# EAGLE schematic LDR2 (EAGLE 8.2.2)
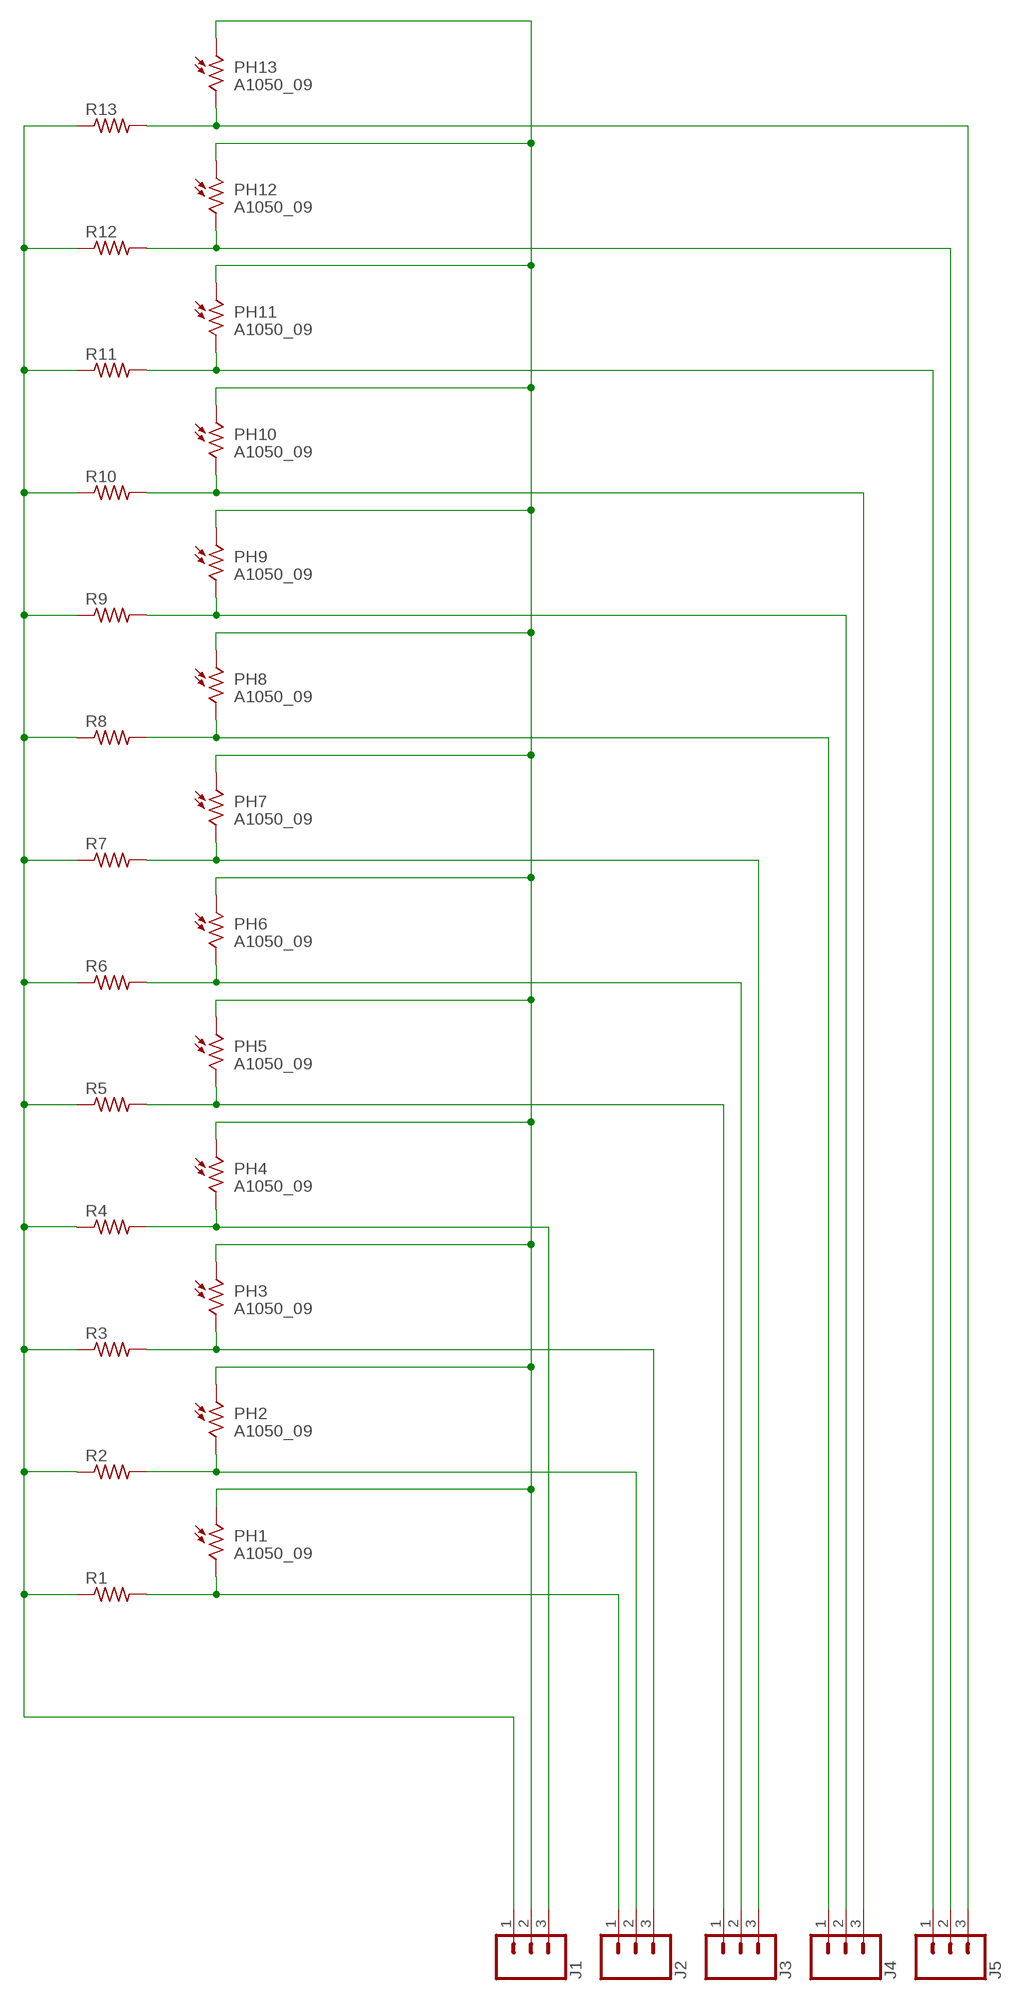
[diagram p0: schematic, sheet 1]

## Parts
J1  CONN_03LONGPADS  [1X03_LONGPADS]
J2  CONN_03LONGPADS  [1X03_LONGPADS]
J3  CONN_03LONGPADS  [1X03_LONGPADS]
J4  CONN_03LONGPADS  [1X03_LONGPADS]
J5  CONN_03LONGPADS  [1X03_LONGPADS]
PH1  A1050_09  [T0-46-A10XX]
PH2  A1050_09  [T0-46-A10XX]
PH3  A1050_09  [T0-46-A10XX]
PH4  A1050_09  [T0-46-A10XX]
PH5  A1050_09  [T0-46-A10XX]
PH6  A1050_09  [T0-46-A10XX]
PH7  A1050_09  [T0-46-A10XX]
PH8  A1050_09  [T0-46-A10XX]
PH9  A1050_09  [T0-46-A10XX]
PH10  A1050_09  [T0-46-A10XX]
PH11  A1050_09  [T0-46-A10XX]
PH12  A1050_09  [T0-46-A10XX]
PH13  A1050_09  [T0-46-A10XX]
R1  R-US_0204/7  [0204/7]
R2  R-US_0204/7  [0204/7]
R3  R-US_0204/7  [0204/7]
R4  R-US_0204/7  [0204/7]
R5  R-US_0204/7  [0204/7]
R6  R-US_0204/7  [0204/7]
R7  R-US_0204/7  [0204/7]
R8  R-US_0204/7  [0204/7]
R9  R-US_0204/7  [0204/7]
R10  R-US_0204/7  [0204/7]
R11  R-US_0204/7  [0204/7]
R12  R-US_0204/7  [0204/7]
R13  R-US_0204/7  [0204/7]

## Nets
5V: J1.1 R1.1 R2.1 R3.1 R4.1 R5.1 R6.1 R7.1 R8.1 R9.1 R10.1 R11.1 R12.1 R13.1
GND: J1.2 PH1.1 PH2.1 PH3.1 PH4.1 PH5.1 PH6.1 PH7.1 PH8.1 PH9.1 PH10.1 PH11.1 PH12.1 PH13.1
N$2: J2.1 PH1.2 R1.2
N$3: J2.2 PH2.2 R2.2
N$4: J2.3 PH3.2 R3.2
N$5: J1.3 PH4.2 R4.2
N$6: J3.1 PH5.2 R5.2
N$7: J3.2 PH6.2 R6.2
N$8: J3.3 PH7.2 R7.2
N$9: J4.1 PH8.2 R8.2
N$10: J4.2 PH9.2 R9.2
N$11: J4.3 PH10.2 R10.2
N$12: J5.1 PH11.2 R11.2
N$13: J5.2 PH12.2 R12.2
N$14: J5.3 PH13.2 R13.2

## Library data of the parts
J1-J5 = SparkFun-Connectors:CONN_03: Multi connection point. Often used as Generic Header-pin footprint for 0.1 inch spaced/style header connections On any of the 0.1 inch spaced packages, you can populate with these: Break Away Headers - Straight <https://www.sparkfun.com/products/116> (PRT-00116) Break Away Male Headers - Right Angle <https://www.sparkfun.com/products/553> (PRT-00553) Female Headers <https://www.sparkfun.com/products/115> (PRT-00115) Break Away Headers - Machine Pin <https://www.sparkfun.com/products/117> (PRT-00117) Break Away Female Headers - Swiss Machine Pin <https://www.sparkfun.com/products/743> (PRT-00743) Stackable Header - 3 Pin (Female, 0.1") <https://www.sparkfun.com/products/13875> (PRT-13875) For SCREWTERMINALS and SPRING TERMINALS visit here: Screw Terimnals on SparkFun.com <https://www.sparkfun.com/search/results?term=Screw+Terminals> (5mm/3.5mm/2.54mm spacing) This device is also useful as a general connection point to wire up your design to another part of your project. Our various solder wires solder well into these plated through hole pads. Hook-Up Wire - Assortment (Stranded, 22 AWG) <https://www.sparkfun.com/products/11375> (PRT-11375) Hook-Up Wire - Assortment (Solid Core, 22 AWG) <https://www.sparkfun.com/products/11367> (PRT-11367) View the entire wire category on our website here <https://www.sparkfun.com/categories/141> Special notes: Molex polarized connector foot print use with SKU : PRT-08232 with associated crimp pins and housings.
PH1-PH13 = photo-elements:A10: Sensor Robust Light Sensing Applications Outdoor Light Sensing Application Source: http://optoelectronics.perkinelmer.com/content/Datasheets/DTS_PhotocellsA1050.pdf
R1-R13 = adafruit:R-US_: RESISTOR, American symbol